# Altium schematic sheet WX0.011.910DL.SchDoc
size A3; Date: 2023/9/20; DocumentNumber: WX0.008.790DL
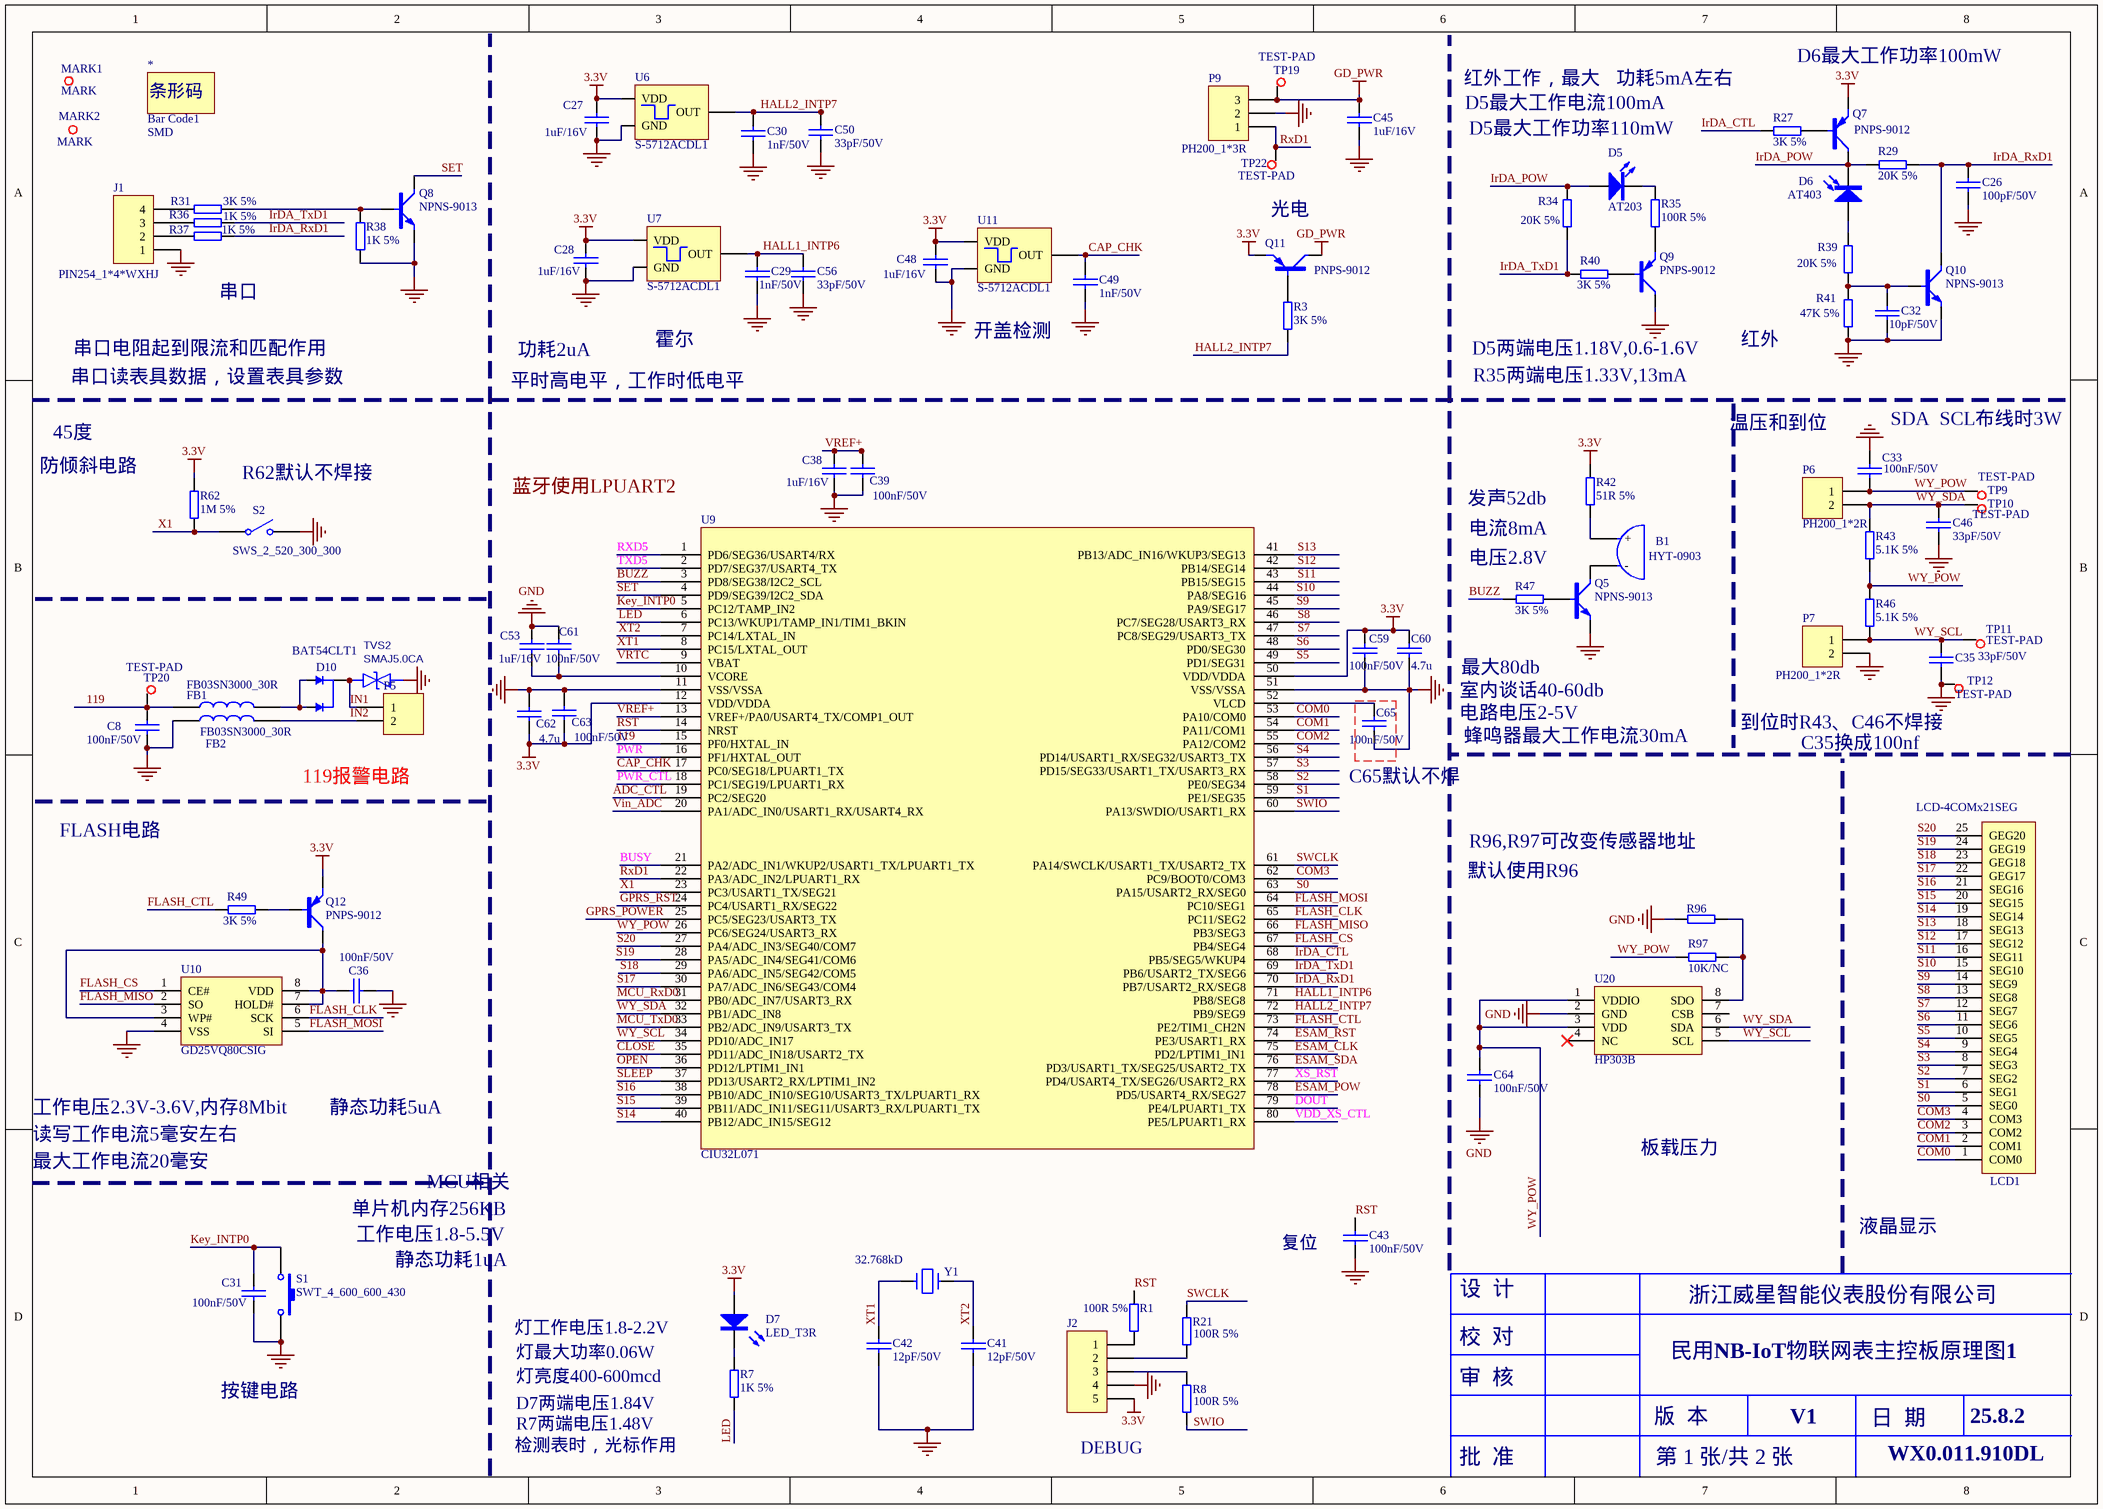
[diagram p0: WX0.011.910DL.SchDoc]

## Parts
*  Bar Code1  SMD/DIP: SMD  [Bar Code1]
B1  HYT-0903  [HYT-0903]
C8  100nF/50V  [CAP0603]
C26  100pF/50V  [CAP0603]
C27  1uF/16V  [CAP0603]
C28  1uF/16V  [CAP0603]
C29  1nF/50V  [CAP0603]
C30  1nF/50V  [CAP0603]
C31  100nF/50V  [CAP0603]
C32  10pF/50V  [CAP0603]
C33  100nF/50V  [CAP0603]
C35  33pF/50V  [CAP0603]
C36  100nF/50V  [CAP0603]
C38  1uF/16V  [CAP0603]
C39  100nF/50V  [CAP0603]
C41  12pF/50V  [CAP0603]
C42  12pF/50V  [CAP0603]
C43  100nF/50V  [CAP0603]
C45  1uF/16V  [CAP0603]
C46  33pF/50V  [CAP0603]
C48  1uF/16V  [CAP0603]
C49  1nF/50V  [CAP0603]
C50  33pF/50V  [CAP0603]
C53  1uF/16V  [CAP0603]
C56  33pF/50V  [CAP0603]
C59  100nF/50V  [CAP0603]
C60  4.7u  [CAP0603]
C61  100nF/50V  [CAP0603]
C62  4.7u  [CAP0603]
C63  100nF/50V  [CAP0603]
C64  100nF/50V  [CAP0603]
C65  100nF/50V  [CAP0603]
D5  AT203  [IR_254_532_300]
D6  AT403  [IR_254_532_300]
D7  LED_T3R  [LED2_300]
D10  BAT54CLT1  [SOT-23]
FB1  FB03SN3000_30R  [IND0603]
FB2  FB03SN3000_30R  [IND0603]
J1  PIN254_1*4*WXHJ  [PIN254_1*4*WXHJ]
J2  PIN254_1*5*WXHJ  [PIN254_1*5*1100S]  (value not drawn)
LCD1  SMD/DIP: LCD-4COMx21SEG  [LCD_GVH21861A-HPP]  (hidden comment: GVH21861A-HPP)
MARK1  MARK  [MARK]
MARK2  MARK  [MARK]
P5  (no value)  [WXHJ_Connect_01]
P6  PH200_1*2R  [PH200_1*2R]
P7  PH200_1*2R  [PH200_1*2R]
P9  PH200_1*3R  [PH200_1*3R]
Q5  NPNS-9013  [SOT-23]
Q7  PNPS-9012  [SOT-23]
Q8  NPNS-9013  [SOT-23]
Q9  PNPS-9012  [SOT-23]
Q10  NPNS-9013  [SOT-23]
Q11  PNPS-9012  [SOT-23]
Q12  PNPS-9012  [SOT-23]
R1  100R 5%  [RES0603]
R3  3K 5%  [RES0603]
R7  1K 5%  [RES0603]
R8  100R 5%  [RES0603]
R21  100R 5%  [RES0603]
R27  3K 5%  [RES0603]
R29  20K 5%  [RES0603]
R31  3K 5%  [RES0603]
R34  20K 5%  [RES0603]
R35  100R 5%  [RES0603]
R36  1K 5%  [RES0603]
R37  1K 5%  [RES0603]
R38  1K 5%  [RES0603]
R39  20K 5%  [RES0603]
R40  3K 5%  [RES0603]
R41  47K 5%  [RES0603]
R42  51R 5%  [RES0603]
R43  5.1K 5%  [RES0603]
R46  5.1K 5%  [RES0603]
R47  3K 5%  [RES0603]
R49  3K 5%  [RES0603]
R62  1M 5%  [RES0603]
R96  0R 5%  [RES0603]  (value not drawn)
R97  10K/NC  [RES0603]
S1  SWT_4_600_600_430  [SWT_4_600_600]
S2  SWS_2_520_300_300  [SWS_2_520_300]
TP9  TEST-PAD  [TEST-PAD]
TP10  TEST-PAD  [TEST-PAD]
TP11  TEST-PAD  [TEST-PAD]
TP12  TEST-PAD  [TEST-PAD]
TP19  TEST-PAD  [TEST-PAD]
TP20  TEST-PAD  [TEST-PAD]
TP22  TEST-PAD  [TEST-PAD]
TVS2  SMAJ5.0CA  [SMAJ5.0CA]
U6  S-5712ACDL1  [SOT-23]
U7  S-5712ACDL1  [SOT-23]
U9  CIU32L071
U10  GD25VQ80CSIG
U11  S-5712ACDL1  [SOT-23]
U20  HP303B  [LGA_8]
Y1  32.768kD  [SMD-3215_2P]

## Nets
3.3V: C27.1 C28.1 C48.1 C59.1 C60.1 C62.2 C63.2 D7.1 J2.5 Q7.2(E) Q11.2(E) Q12.2(E) R42.2 R62.2 U6.1(VDD) U7.1(VDD) U9.12(VDD/VDDA) U9.50(VDD/VDDA) U11.1(VDD)
GD_PWR: C45.1 P9.3 Q11.3(C) TP19.1
GND: C8.2 C26.2 C27.2 C28.2 C29.2 C30.2 C31.2 C32.2 C33.1 C35.2 C36.2 C38.2 C39.2 C41.1 C42.2 C43.1 C45.2 C46.2 C48.2 C49.2 C50.2 C53.1 C56.2 C59.2 C60.2 C61.1 C62.1 C63.1 C64.1 C65.2 FB2.1 J1.1 J2.4 P7.2 P9.2 Q5.2(E) Q8.2(E) Q9.3(C) Q10.2(E) R38.1 R41.1 R96.1 S1.2 S2.2 TP12.1 TVS2.1 U6.3(GND) U7.3(GND) U9.11(VSS/VSSA) U9.51(VSS/VSSA) U10.4(VSS) U11.3(GND) U20.2(GND)
119: C8.1 FB1.1 TP20.1 U9.15(PF0/HXTAL_IN)
ADC_CTL: U9.19(PC2/SEG20)
BUSY: U9.21(PA2/ADC_IN1/WKUP2/USART1_TX/LPUART1_TX)
BUZZ: R47.1 U9.3(PD8/SEG38/I2C2_SCL)
CAP_CHK: C49.1 U9.17(PC0/SEG18/LPUART1_TX) U11.2(OUT)
CLOSE: U9.35(PD11/ADC_IN18/USART2_TX)
COM0: LCD1.1(COM0) U9.53(PA10/COM0)
COM1: LCD1.2(COM1) U9.54(PA11/COM1)
COM2: LCD1.3(COM2) U9.55(PA12/COM2)
COM3: LCD1.4(COM3) U9.62(PC9/BOOT0/COM3)
DOUT: U9.79(PE4/LPUART1_TX)
ESAM_CLK: U9.75(PD2/LPTIM1_IN1)
ESAM_POW: U9.78(PD5/USART4_RX/SEG27)
ESAM_RST: U9.74(PE3/USART1_RX)
ESAM_SDA: U9.76(PD3/USART1_TX/SEG25/USART2_TX)
FLASH_CLK: U9.65(PC11/SEG2) U10.6(SCK)
FLASH_CS: U9.67(PB4/SEG4) U10.1(CE#)
FLASH_CTL: R49.1 U9.73(PE2/TIM1_CH2N)
FLASH_MISO: U9.66(PB3/SEG3) U10.2(SO)
FLASH_MOSI: U9.64(PC10/SEG1) U10.5(SI)
GPRS_POWER: U9.25(PC5/SEG23/USART3_TX)
GPRS_RST: U9.24(PC4/USART1_RX/SEG22)
HALL1_INTP6: C29.1 C56.1 U7.2(OUT) U9.71(PB8/SEG8)
HALL2_INTP7: C30.1 C50.1 R3.1 U6.2(OUT) U9.72(PB9/SEG9)
IN1: D10.3(C) P5.1 TVS2.2
IN2: FB2.2 P5.2
IrDA_CTL: R27.1 U9.68(PB5/SEG5/WKUP4)
IrDA_POW: D5.1(A) D6.2(K) Q7.3(C) R29.1 R34.2
IrDA_RxD1: C26.1 Q10.3(C) R29.2 R37.2 U9.70(PB7/USART2_RX/SEG8)
IrDA_TxD1: R34.1 R36.2 R40.1 U9.69(PB6/USART2_TX/SEG6)
Key_INTP0: C31.1 S1.1 U9.5(PC12/TAMP_IN2)
LED: R7.1 U9.6(PC13/WKUP1/TAMP_IN1/TIM1_BKIN)
MCU_RxD0: U9.31(PB0/ADC_IN7/USART3_RX)
MCU_TxD0: U9.33(PB2/ADC_IN9/USART3_TX)
OPEN: U9.36(PD12/LPTIM1_IN1)
PWR: U9.16(PF1/HXTAL_OUT)
PWR_CTL: U9.18(PC1/SEG19/LPUART1_RX)
RST: C43.2 R1.1 U9.14(NRST)
RxD1: P9.1 TP22.1 U9.22(PA3/ADC_IN2/LPUART1_RX)
RXD5: U9.1(PD6/SEG36/USART4/RX)
S0: LCD1.5(SEG0) U9.63(PA15/USART2_RX/SEG0)
S1: LCD1.6(SEG1) U9.59(PE1/SEG35)
S2: LCD1.7(SEG2) U9.58(PE0/SEG34)
S3: LCD1.8(SEG3) U9.57(PD15/SEG33/USART1_TX/USART3_RX)
S4: LCD1.9(SEG4) U9.56(PD14/USART1_RX/SEG32/USART3_TX)
S5: LCD1.10(SEG5) U9.49(PD1/SEG31)
S6: LCD1.11(SEG6) U9.48(PD0/SEG30)
S7: LCD1.12(SEG7) U9.47(PC8/SEG29/USART3_TX)
S8: LCD1.13(SEG8) U9.46(PC7/SEG28/USART3_RX)
S9: LCD1.14(SEG9) U9.45(PA9/SEG17)
S10: LCD1.15(SEG10) U9.44(PA8/SEG16)
S11: LCD1.16(SEG11) U9.43(PB15/SEG15)
S12: LCD1.17(SEG12) U9.42(PB14/SEG14)
S13: LCD1.18(SEG13) U9.41(PB13/ADC_IN16/WKUP3/SEG13)
S14: LCD1.19(SEG14) U9.40(PB12/ADC_IN15/SEG12)
S15: LCD1.20(SEG15) U9.39(PB11/ADC_IN11/SEG11/USART3_RX/LPUART1_TX)
S16: LCD1.21(SEG16) U9.38(PB10/ADC_IN10/SEG10/USART3_TX/LPUART1_RX)
S17: LCD1.22(GEG17) U9.30(PA7/ADC_IN6/SEG43/COM4)
S18: LCD1.23(GEG18) U9.29(PA6/ADC_IN5/SEG42/COM5)
S19: LCD1.24(GEG19) U9.28(PA5/ADC_IN4/SEG41/COM6)
S20: LCD1.25(GEG20) U9.27(PA4/ADC_IN3/SEG40/COM7)
SET: Q8.3(C) U9.4(PD9/SEG39/I2C2_SDA)
SLEEP: U9.37(PD13/USART2_RX/LPTIM1_IN2)
SWCLK: R21.1 U9.61(PA14/SWCLK/USART1_TX/USART2_TX)
SWIO: R8.2 U9.60(PA13/SWDIO/USART1_RX)
TXD5: U9.2(PD7/SEG37/USART4_TX)
VDD_XS_CTL: U9.80(PE5/LPUART1_RX)
Vin_ADC: U9.20(PA1/ADC_IN0/USART1_RX/USART4_RX)
VREF+: C38.1 C39.1 U9.13(VREF+/PA0/USART4_TX/COMP1_OUT)
VRTC: U9.9(VBAT)
WY_POW: C33.2 C64.2 P6.1 R43.1 R46.2 R97.2 TP9.1 U9.26(PC6/SEG24/USART3_RX) U20.1(VDDIO) U20.3(VDD)
WY_SCL: C35.1 P7.1 R46.1 TP11.1 U9.34(PD10/ADC_IN17) U20.5(SCL)
WY_SDA: C46.1 P6.2 R43.2 TP10.1 U9.32(PB1/ADC_IN8) U20.6(SDA)
X1: R62.1 S2.1 U9.23(PC3/USART1_TX/SEG21)
XS_RST: U9.77(PD4/USART4_TX/SEG26/USART2_RX)
XT1: C42.1 U9.8(PC15/LXTAL_OUT) Y1.1
XT2: C41.2 U9.7(PC14/LXTAL_IN) Y1.2
NetB1_1: B1.1(+) R42.1
NetB1_2: B1.2(-) Q5.3(C)
NetC32_1: C32.1 Q10.1(B) R39.1 R41.2
NetC36_1: C36.1 Q12.3(C) U10.3(WP#) U10.7(HOLD#) U10.8(VDD)
NetC53_2: C53.2 C61.2 U9.10(VCORE)
NetC65_1: C65.1 U9.52(VLCD)
NetD5_2: D5.2(K) R35.2
NetD6_1: D6.1(A) R39.2
NetD7_2: D7.2 R7.2
NetD10_1: D10.1(A) D10.2(A) FB1.2
NetJ1_2: J1.2 R37.1
NetJ1_3: J1.3 R36.1
NetJ1_4: J1.4 R31.1
NetJ2_1: J2.1 R1.2
NetJ2_2: J2.2 R21.2
NetJ2_3: J2.3 R8.1
NetQ5_1: Q5.1(B) R47.2
NetQ7_1: Q7.1(B) R27.2
NetQ8_1: Q8.1(B) R31.2 R38.2
NetQ9_1: Q9.1(B) R40.2
NetQ9_2: Q9.2(E) R35.1
NetQ11_1: Q11.1(B) R3.2
NetQ12_1: Q12.1(B) R49.2
NetR96_2: R96.2 R97.1 U20.8(SDO)

Not connected (* = marked no-connect by the designer): U20 4(NC)* 7(CSB)

## Notes on the sheet
- 红外工作，最大
- D5最大工作电流100mA
- 功耗5mA左右
- D6最大工作功率100mW
- D5最大工作功率110mW
- 光电
- 串口
- 串口读表具数据，设置表具参数
- 串口电阻起到限流和匹配作用
- 功耗2uA
- 霍尔
- 开盖检测
- D5两端电压1.18V,0.6-1.6V
- R35两端电压1.33V,13mA
- 红外
- 45度
- 平时高电平，工作时低电平
- 温压和到位
- SDA  SCL布线时3W
- 防倾斜电路
- R62默认不焊接
- 蓝牙使用LPUART2
- 发声52db
- 电流8mA
- 电压2.8V
- 电路电压2-5V
- 室内谈话40-60db
- 最大80db
- 119报警电路
- (near C65) C65默认不焊
- 蜂鸣器最大工作电流30mA
- 到位时R43、C46不焊接
- C35换成100nf
- FLASH电路
- R96,R97可改变传感器地址
- 默认使用R96
- 工作电压2.3V-3.6V,内存8Mbit
- 静态功耗5uA
- 读写工作电流5毫安左右
- 最大工作电流20毫安
- 单片机内存256KB
- MCU相关
- 板载压力
- 工作电压1.8-5.5V
- 静态功耗1uA
- 复位
- 液晶显示
- 设  计
- 浙江威星智能仪表股份有限公司
- 按键电路
- 灯工作电压1.8-2.2V
- 灯最大功率0.06W
- 灯亮度400-600mcd
- 审  核
- 校  对
- 民用NB-IoT物联网表主控板原理图1
- 检测表时，光标作用
- D7两端电压1.84V
- R7两端电压1.48V
- (near J2) DEBUG
- 版  本
- V1
- 日  期
- WX0.011.910DL
- 25.8.2
- 批  准
- 第 1 张/共 2 张
- 设   计
- 校   对
- 邓琴琴
- 冯翰
- 审   核
- 标准化
- 版本
- 日期
- 批   准
- 刘晓峰
- 第       张  /  共       张

## Library data of the parts
* = AD_WXHJ_Bar Code_02: 条形码 ,填充，无需焊接器件; ID: 17; Part Number: AD_WXHJ_Bar Code_02; Part Name: 条形码
B1 = 1010602-0007: 直插,直径9mm,高5.5mm,5 V,2 V,30 mA,兴化市华宇电子有限公司,HYT-0903; Part Name: 有源蜂鸣器; ID: 28; SMD/DIP: DIP; Part Number: 1010602-0007
C8 C31 C33 C36 C39 C43 C59-C65 = 101020103-0021: 104pF,50 V,±10%,0603,国巨,CC0603KRX7R9BB104; Part Name: 0603贴片电容; ID: 3; SMD/DIP: SMD; Part Number: 101020103-0021
C26 = 101020103-0010: 101pf,50 V,±5%,0603,国巨,CC0603JRNP09BN101; Part Name: 0603贴片电容; ID: 4; SMD/DIP: SMD; Part Number: 101020103-0010
C27 C28 C38 C45 C48 C53 = 101020103-0003: 105pF,16 V,±10%,0603,国巨,CC0603KRX7R7BB105; Part Name: 0603贴片电容; ID: 14; SMD/DIP: SMD; Part Number: 101020103-0003
C29 C30 C49 = 101020103-0022: 102pF,50 V,±10%,0603,国巨,CC0603KRX7R9BB102; Part Name: 0603贴片电容; ID: 13; SMD/DIP: SMD; Part Number: 101020103-0022
C32 = 101020103-0014: 10pF,50 V,±5%,0603,X7R,国巨,CC0603JRNPO9BN100; Part Name: 0603贴片电容; ID: 7; SMD/DIP: SMD; Part Number: 101020103-0014
C35 = 101020103-0021: Part Name: 0603贴片电容; ID: 3; SMD/DIP: SMD; Part Number: 101020103-0021
C41 C42 = 101020103-0005: 12P,50 V,±5%,0603,国巨,CC0603JRNPO9BN12; Part Name: 0603贴片电容; ID: 11; SMD/DIP: SMD; Part Number: 101020103-0005
C46 = 101020103-0027: 33pF,50 V,±10%,0603,国巨,CC0603KRNPO9BN33; Part Name: 0603贴片电容; ID: 18; SMD/DIP: SMD; Part Number: 101020103-0027
C50 C56 = 101020103-0027: 33pF,50 V,±10%,0603,国巨,CC0603KRNPO9BN33; Part Name: 0603贴片电容; ID: 17; SMD/DIP: SMD; Part Number: 101020103-0027
D5 = 101040102-0010: DIP-2,φ3,插件,红光,上海品观电子有限公司/可得,AT203; Part Name: 红外发射管; ID: 1; SMD/DIP: DIP; Part Number: 101040102-0010
D6 = 101040102-0011: DIP-2,φ3,插件,红光,上海品观电子有限公司/可得,AT403-PD-01; Part Name: 光敏二极管; ID: 3; SMD/DIP: DIP; Part Number: 101040102-0011
D7 = 101040102-0001: 圆形插件,3mm 圆形,插件,红光,湖北匡通电子有限公司,3BB4HC; Part Name: 发光二极管; ID: 6; SMD/DIP: DIP; Part Number: 101040102-0001
D10 = 101040101-0038: BAT54CLT1，SOT23-3,SOT23-3,0.2 A,0.8 V,30 V,安森美,BAT54CLT1; Part Name: 贴片肖特基; ID: 31; SMD/DIP: SMD; Part Number: 101040101-0038
FB1 FB2 = 109010101-0003: chilisin(奇力新),0603,30Ω ±25% @100MHz,150 V,125 ℃,PBY160808T-300Y-N,-55 ℃,不含铅,,,圆盘,30Ω ±25% @100MHz; Part Name: 磁珠; ID: 25; SMD/DIP: SMD; Part Number: 109010101-0003
J1 = AD_WXHJ_PinHeader_01: 1*4 ，Φ1.0 ，2.54mm，直脚,无需焊接器件; Part Name: 排针; ID: 16; SMD/DIP: DIP; Part Number: AD_WXHJ_PinHeader_01
J2 = AD_WXHJ_PinHeader_02: 1*5 ，Φ1.0 ，2.54mm，直脚,无需焊接器件; Part Name: 排针; ID: 17; SMD/DIP: DIP; Part Number: AD_WXHJ_PinHeader_02
LCD1 = 1010801-0028: GVH21861A-HPP/GVH20913A－HPP-WG,65*23mm,针脚,段码,21,液晶,全透,60 ℃,-20 ℃,金视界/合肥精显,GVH21861A-HPP/GVH20913A－HPP-WG; Part Name: LCD液晶屏; ID: 8; Part Number: 1010801-0028
MARK1 MARK2 = AD_WXHJ_MARK_01: MARK点; ID: 8; SMD/DIP: SMD; Part Number: AD_WXHJ_MARK_01; Part Name: MARK点
P5 = AD_WXHJ_Connect_01: 电源连接线; Part Name: 电源线焊盘; ID: 26; SMD/DIP: DIP; Part Number: AD_WXHJ_Connect_01
P6 P7 = 1010902-0105: 2.0-2AW,直插弯座，2PIN，脚间距2mm，带防翘起,公头,单排,2.0-2AW;直插弯座，2PIN,脚间距2mm，带防翘起; Part Name: PH座; ID: 11; SMD/DIP: DIP; Part Number: 1010902-0105
P9 = 1010902-0104: 2.0-3AW,3PIN，2mm脚间距,公头,单排,2.0-3AW；3PIN，脚间距2mm直插弯座带防翘起; Part Name: PH座; ID: 12; SMD/DIP: DIP; Part Number: 1010902-0104
Q5 Q8 Q10 = 101040201-0002: 9013,NPN,SOT-23,长电,S9013; Part Name: 贴片三极管; ID: 14; SMD/DIP: SMD; Part Number: 101040201-0002
Q7 Q9 Q11 Q12 = 101040201-0001: 9012,PNP,SOT-23,JCET;长电,S9012; Part Name: 贴片三极管; ID: 16; SMD/DIP: SMD; Part Number: 101040201-0001
R1 R8 R21 R35 = 101010103-0022: 100R,±5%,1/10W,0603,国巨,RC0603JR-07100RL; Part Name: 0603贴片电阻; ID: 5; SMD/DIP: SMD; Part Number: 101010103-0022
R3 R27 R31 R40 R47 R49 = 101010103-0006: 国巨,±5%,0603,,155 ℃,-55 ℃,RC0603JR-073KL,无铅,100 ppm/℃,1/10W,,3K; Part Name: 0603贴片电阻; ID: 22; SMD/DIP: SMD; Part Number: 101010103-0006
R7 R36 R37 = 101010103-0008: 1K,±5%,1/10W,0603,国巨,RC0603JR-071KL; Part Name: 0603贴片电阻; ID: 9; SMD/DIP: SMD; Part Number: 101010103-0008
R29 R34 R39 = 101010103-0004: 国巨,±5%,0603,,155 ℃,-55 ℃,RC0603JR-0720KL,无铅,200 ppm/℃,1/10W,,20K; Part Name: 0603贴片电阻; ID: 15; SMD/DIP: SMD; Part Number: 101010103-0004
R38 = 101010103-0008: 1K,±5%,1/10W,0603,国巨,RC0603JR-071KL; Part Name: 0603贴片电阻; ID: 10; SMD/DIP: SMD; Part Number: 101010103-0008
R41 = 101010103-0012: 47K,±5%,1/10W,0603,国巨,RC0603JR-0747KL; Part Name: 0603贴片电阻; ID: 25; SMD/DIP: SMD; Part Number: 101010103-0012
R42 = 101010103-0037: 国巨,±5%,0603,,155 ℃,-55 ℃,RC0603JR-0751RL,无铅,100 ppm/℃,1/10W,,51欧; Part Name: 0603贴片电阻; ID: 28; SMD/DIP: SMD; Part Number: 101010103-0037
R43 R46 = 101010103-0015: 国巨,±5%,0603,,155 ℃,55 ℃,RC0603JR-075.1KL,无铅,200 ppm/℃,1/10W,,5.1k; Part Name: 0603贴片电阻; ID: 26; SMD/DIP: SMD; Part Number: 101010103-0015
R62 = 101010103-0002: 国巨,±5%,0603,,155 ℃,-55 ℃,RC0603JR-071ML,无铅,200 ppm/℃,1/10W,,1M; Part Name: 0603贴片电阻; ID: 11; SMD/DIP: SMD; Part Number: 101010103-0002
R96 = 101010103-0001: 国巨,±5%,0603,,155 ℃,-55 ℃,RC0603J2-070RL,无铅,200 ppm/℃,1/10W,,0R; Part Name: 0603贴片电阻; ID: 1; SMD/DIP: SMD; Part Number: 101010103-0001
R97 = 101010103-0002: 国巨,±5%,0603,,155 ℃,-55 ℃,RC0603JR-071ML,无铅,200 ppm/℃,1/10W,,1M
S1 = 1011001-0027: TS-1102,机械轻触,6*6*4.3直插,6*6*4.3直插,乐清市羽欧电子; Part Name: 按键; ID: 30; SMD/DIP: DIP; Part Number: 1011001-0027
S2 = 1011001-0041: CSX-SEN-645B,垂直45°开关转换,3*5.2mm,360°任意方位倾斜检测,深圳市成晟科技有限公司; Part Number: 1011001-0051; Part Name: 倾斜开关; ID: 33; SMD/DIP: SMD
TP9-TP12 TP19 TP20 TP22 = AD_WXHJ_TEST-PAD_01: 单面焊盘测试点; Part Name: 测试点; ID: 23; SMD/DIP: SMD; Part Number: AD_WXHJ_TEST-PAD_01
TVS2 = SMAJ5.0CA_C693487: BOM_Manufacturer: FTR; Contributor: LCSC; BOM_Supplier: LCSC; BOM_Supplier Part: C693487; BOM_Manufacturer Part: SMAJ5.0CA; BOM_JLCPCB Part Class: Extended Part; spicePre: D; spiceSymbolName: SMAJ5.0CA_C693487
U6 U7 U11 = 1010504-0002: S-5712ACDL1,SOT23-3,3.5 V,1.6 V,2 uA,精工电子,S-5712ACDL1; Part Name: 霍尔元件; ID: 2; SMD/DIP: SMD; Part Number: 1010504-0002
U9 = CIU32L061
U10 = 04_GD25VQ80CSIG
U20 = HP303B: Part Number: 1011301-0022
Y1 = 1010601-0009: Part Number: 1010601-0020; Part Name: 贴片晶振; ID: 20; SMD/DIP: SMD